# Altium project WATSH.PrjPCB
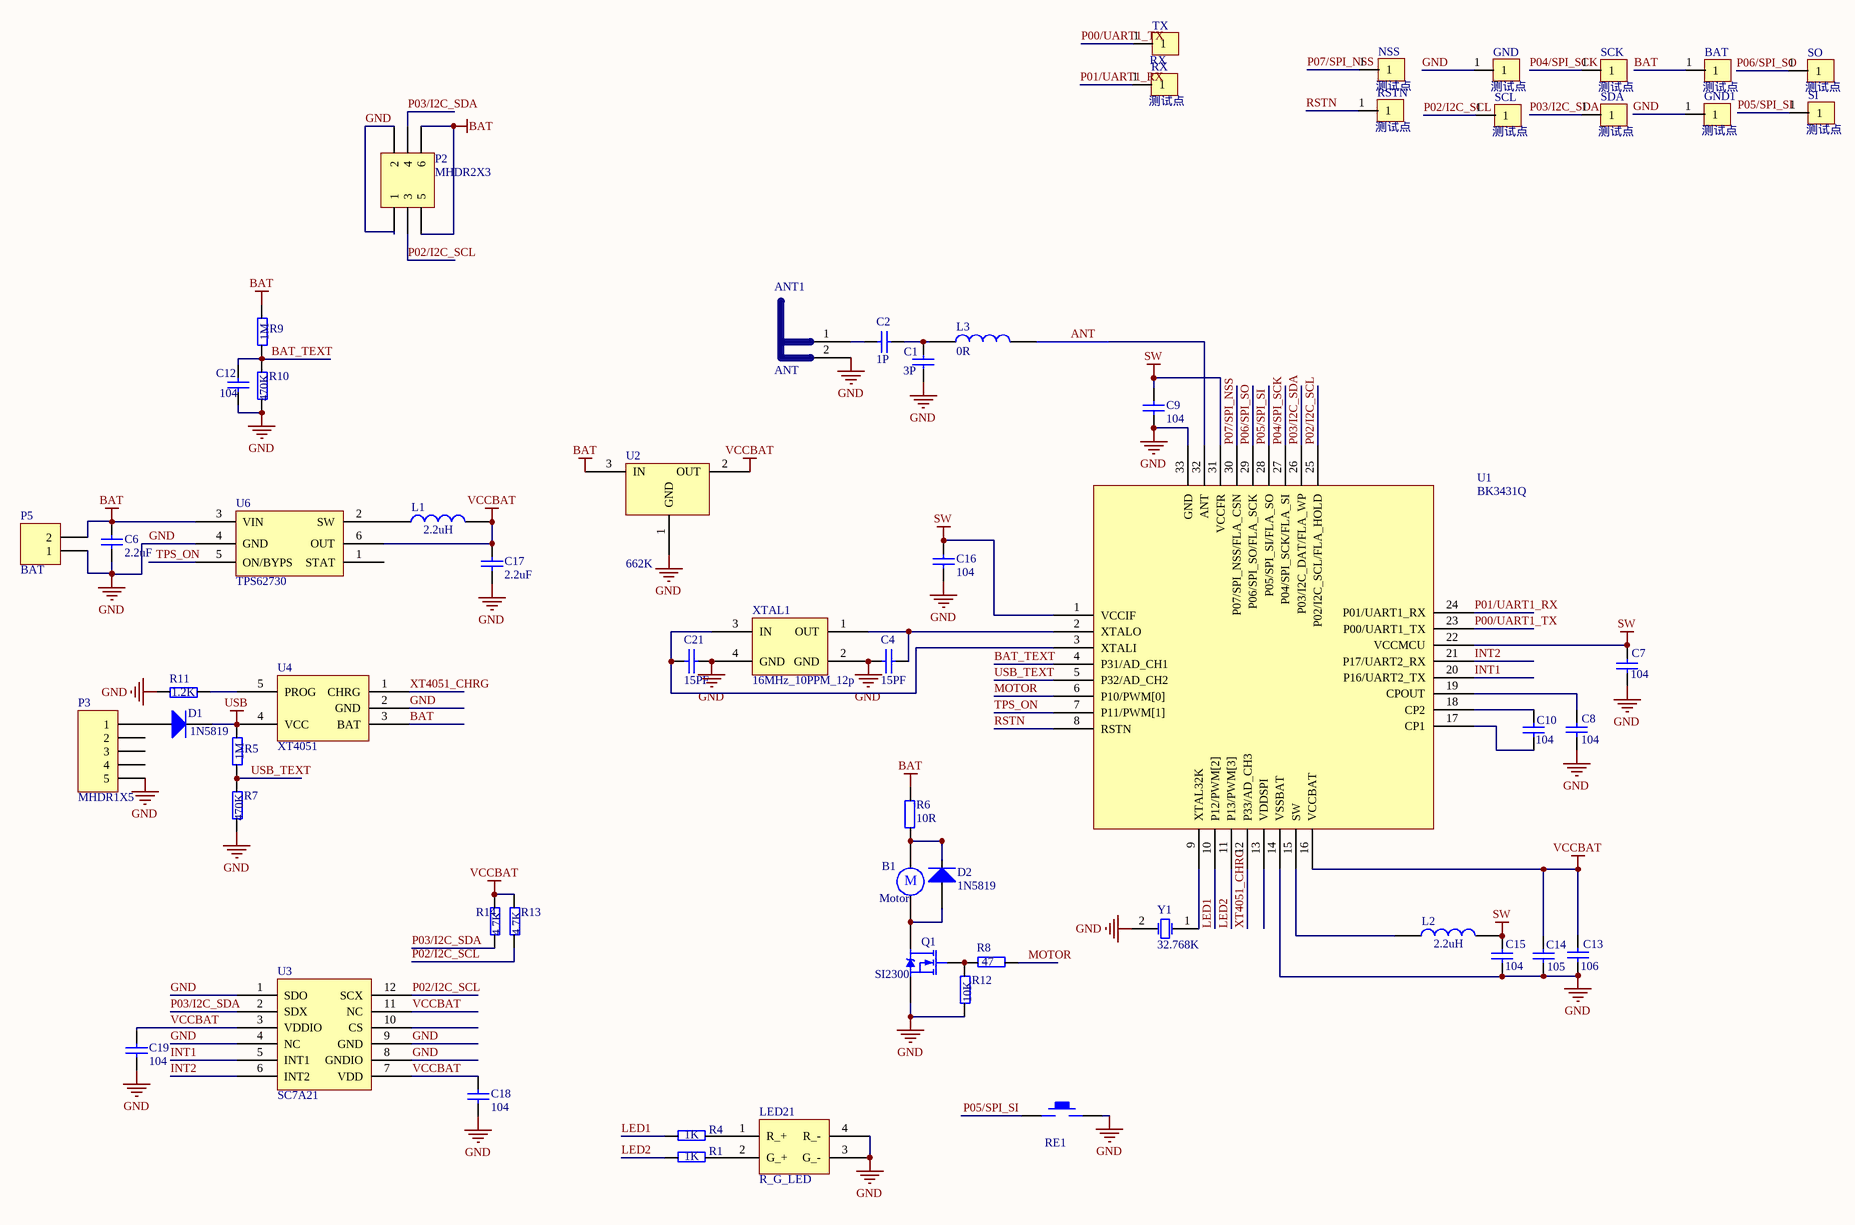
[diagram p0: WATSH2.SchDoc]
1 sheet, 61 parts. Net scope: global (net labels, ports and power ports of the same name join across sheets).
Board file: WATSH.PcbDoc

## Sheet WATSH2.SchDoc
size A2

### Parts
ANT1  ANT  [3216]
B1  Motor  [MODER]
BAT  测试点  [TEXT_POINT]
C1  3P  [0402_C]
C2  1P  [0402_C]
C4  15PF  [0402_C]
C6  2.2uF  [0402_C]
C7  104  [0402_C]
C8  104  [0402_C]
C9  104  [0402_C]
C10  104  [0402_C]
C12  104  [0402_C]
C13  106  [0402_C]
C14  105  [0402_C]
C15  104  [0402_C]
C16  104  [0402_C]
C17  2.2uF  [0402_C]
C18  104  [0402_C]
C19  104  [0402_C]
C21  15PF  [0402_C]
D1  1N5819  [SOD-323]
D2  1N5819  [SOD-523]
GND  测试点  [TEXT_POINT]
GND1  测试点  [TEXT_POINT]
L1  2.2uH  [0603p]
L2  2.2uH  [0603p]
L3  0R  [0402_L]
LED21  R_G_LED  [0603_R_G_LED]
NSS  测试点  [TEXT_POINT]
P2  MHDR2X3  [AXF-6A-M]
P3  MHDR1X5  [MINI_USB_2P]
P5  BAT  [HDR1X2]
Q1  SI2300  [SOT-523]
R1  1K  [0402_R]
R4  1K  [0402_R]
R5  1M  [0402_R]
R6  10R  [0603_R]
R7  470K  [0402_R]
R8  47  [0603_R]
R9  1M  [0402_R]
R10  470K  [0402_R]
R11  1.2K  [0402_R]
R12  10K  [0402_R]
R13  4.7K  [0402_R]
R14  4.7K  [0402_R]
RE1  KEY_M  [轻触开关 2x4]  (value not drawn)
RSTN  测试点  [TEXT_POINT]
RX  测试点  [TEXT_POINT]
SCK  测试点  [TEXT_POINT]
SCL  测试点  [TEXT_POINT]
SDA  测试点  [TEXT_POINT]
SI  测试点  [TEXT_POINT]
SO  测试点  [TEXT_POINT]
TX  RX  [TEXT_POINT]
U1  BK3431Q  [QFN32]
U2  662K  [SOT-23]
U3  SC7A21  [LGA-12-2*2*1]
U4  XT4051  [SOT-23-5L]
U6  TPS62730  [R-PUSON-N6]
XTAL1  16MHz_10PPM_12p  [晶振2*2.6]
Y1  32.768K  [晶振1.5*3.2]

### Nets
BAT: BAT.1 C6.2 P2.5 P2.6 P5.2 R6.1 R9.2 U2.3(IN) U4.3(BAT) U6.3(VIN)
GND: ANT1.2(GND) C1.1 C4.1 C6.1 C7.1 C8.1 C9.1 C12.1 C13.1 C14.1 C15.1 C16.1 C17.1 C18.2 C19.2 C21.2 GND.1 GND1.1 LED21.3(G_-) LED21.4(R_-) P2.1 P2.2 P3.5 P5.1 Q1.S R7.1 R10.1 R11.2 R12.1 RE1.2 U1.14(VSSBAT) U1.33(GND) U2.1(GND) U3.1(SDO) U3.4(NC) U3.8(GNDIO) U3.9(GND) U4.2(GND) U6.4(GND) XTAL1.2(GND) XTAL1.4(GND) Y1.2(OSC2)
SW: C7.2 C9.2 C15.2 C16.2 L2.1 U1.1(VCCIF) U1.22(VCCMCU) U1.31(VCCFR)
USB: D1.2(K) R5.2 U4.4(VCC)
VCCBAT: C13.2 C14.2 C17.2 C18.1 C19.1 L1.1 R13.2 R14.2 U1.16(VCCBAT) U2.2(OUT) U3.3(VDDIO) U3.7(VDD) U3.11(NC) U6.6(OUT)
ANT: L3.1 U1.32(ANT)
BAT_TEXT: C12.2 R9.1 R10.2 U1.4(P31/AD_CH1)
INT1: U1.20(P16/UART2_TX) U3.5(INT1)
INT2: U1.21(P17/UART2_RX) U3.6(INT2)
LED1: R4.2 U1.10(P12/PWM[2])
LED2: R1.2 U1.11(P13/PWM[3])
MOTOR: R8.1 U1.6(P10/PWM[0])
P00/UART1_TX: TX.1 U1.23(P00/UART1_TX)
P01/UART1_RX: RX.1 U1.24(P01/UART1_RX)
P02/I2C_SCL: P2.3 R13.1 SCL.1 U1.25(P02/I2C_SCL/FLA_HOLD) U3.12(SCX)
P03/I2C_SDA: P2.4 R14.1 SDA.1 U1.26(P03/I2C_DAT/FLA_WP) U3.2(SDX)
P04/SPI_SCK: SCK.1 U1.27(P04/SPI_SCK/FLA_SI)
P05/SPI_SI: RE1.1 SI.1 U1.28(P05/SPI_SI/FLA_SO)
P06/SPI_SO: SO.1 U1.29(P06/SPI_SO/FLA_SCK)
P07/SPI_NSS: NSS.1 U1.30(P07/SPI_NSS/FLA_CSN)
RSTN: RSTN.1 U1.8(RSTN)
TPS_ON: U1.7(P11/PWM[1]) U6.5(ON/BYPS)
USB_TEXT: R5.1 R7.2 U1.5(P32/AD_CH2)
XT4051_CHRG: U1.12(P33/AD_CH3) U4.1(CHRG)
NetANT1_1: ANT1.1(ANT) C2.1
NetB1_1: B1.1 D2.2(K) R6.2
NetB1_2: B1.2 D2.1(A) Q1.D
NetC1_2: C1.2 C2.2 L3.2
NetC4_2: C4.2 U1.2(XTALO) XTAL1.1(OUT)
NetC8_2: C8.2 U1.19(CPOUT)
NetC10_1: C10.1 U1.17(CP1)
NetC10_2: C10.2 U1.18(CP2)
NetC21_1: C21.1 U1.3(XTALI) XTAL1.3(IN)
NetD1_1: D1.1(A) P3.1
NetL1_2: L1.2 U6.2(SW)
NetL2_2: L2.2 U1.15(SW)
NetLED21_1: LED21.1(R_+) R4.1
NetLED21_2: LED21.2(G_+) R1.1
NetQ1_G: Q1.G R8.2 R12.2
NetR11_1: R11.1 U4.5(PROG)
NetU1_9: U1.9(XTAL32K) Y1.1(OSC1)

Not connected (* = marked no-connect by the designer): P3 2 3 4; U1 13(VDDSPI); U3 10(CS); U6 1(STAT)

### Notes on the sheet
- (in symbol Motor) M

### Library data of the parts
B1 = Motor: Motor, General Kind; Published: 24-Mar-1999; LatestRevisionDate: 17-Jul-2002; LatestRevisionNote: Re-released for DXP Platform.; PackageReference: RB5-10.5; Publisher: Altium Limited; PackageDescription: Capacitor (Radial); 2 Leads
C1 C2 C6-C10 C12-C19 = Cap: Capacitor; Value: 10UF; Published: 8-Jun-2000; LatestRevisionDate: 17-Jul-2002; LatestRevisionNote: Re-released for DXP Platform.; PackageReference: RAD-0.3; Publisher: Altium Limited; PackageDescription: Radial Cap, Thru-Hole; 2 Leads; 0.3 in Pin Spacing
C4 C21 = CAP: Capacitor
D1 D2 = Diode 1N4001: 1 Amp General Purpose Rectifier; Published: 8-Jun-2000; LatestRevisionDate: 17-Jul-2002; LatestRevisionNote: Re-released for DXP Platform.; DatasheetVersion: 1998; PackageVersion: Aug-1999; PackageReference: DO-41; Publisher: Altium Limited; PackageDescription: Diode, Axial; Body 5.2 x 2.7 mm (LxDia. max), Lead Dia. 0.86 mm (max); Code_JEDEC: DO-204-AL; ComponentLink1Description: Manufacturer Link; ComponentLink1URL: http://www.fairchildsemi.com/; ComponentLink2Description: Datasheet; ComponentLink2URL: http://www.fairchildsemi.com/ds/1N%2F1N4001.pdf
L1-L3 = INDUCTOR
P2 = MHDR2X3: Header, 3-Pin, Dual row; LatestRevisionDate: 17-Jul-2002; LatestRevisionNote: Re-released for DXP Platform.; Publisher: Altium Limited
P3 = MHDR1X5: Header, 5-Pin; LatestRevisionDate: 17-Jul-2002; LatestRevisionNote: Re-released for DXP Platform.; Publisher: Altium Limited
P5 = Header 2: Header, 2-Pin; LatestRevisionDate: 17-Jul-2002; LatestRevisionNote: Re-released for DXP Platform.; Publisher: Altium Limited
Q1 = MOSFET-N: N-Channel MOSFET; pin to pad: D>3 G>1 S>2; PackageDocument: 1995/1996; Published: 8-Jun-2000; LatestRevisionDate: 17-Jul-2002; LatestRevisionNote: Re-released for DXP Platform.; PackageReference: E3; Publisher: Altium Limited
R1 R4-R14 = R
TX = 测试点
XTAL1 = 晶振
Y1 = XTAL_1: Crystal Oscillator; Published: 8-Jun-2000; LatestRevisionDate: 17-Jul-2002; LatestRevisionNote: Re-released for DXP Platform.; Publisher: Altium Limited